# Altium schematic sheet Charger_S.CAP_BAT.SchDoc
size A3
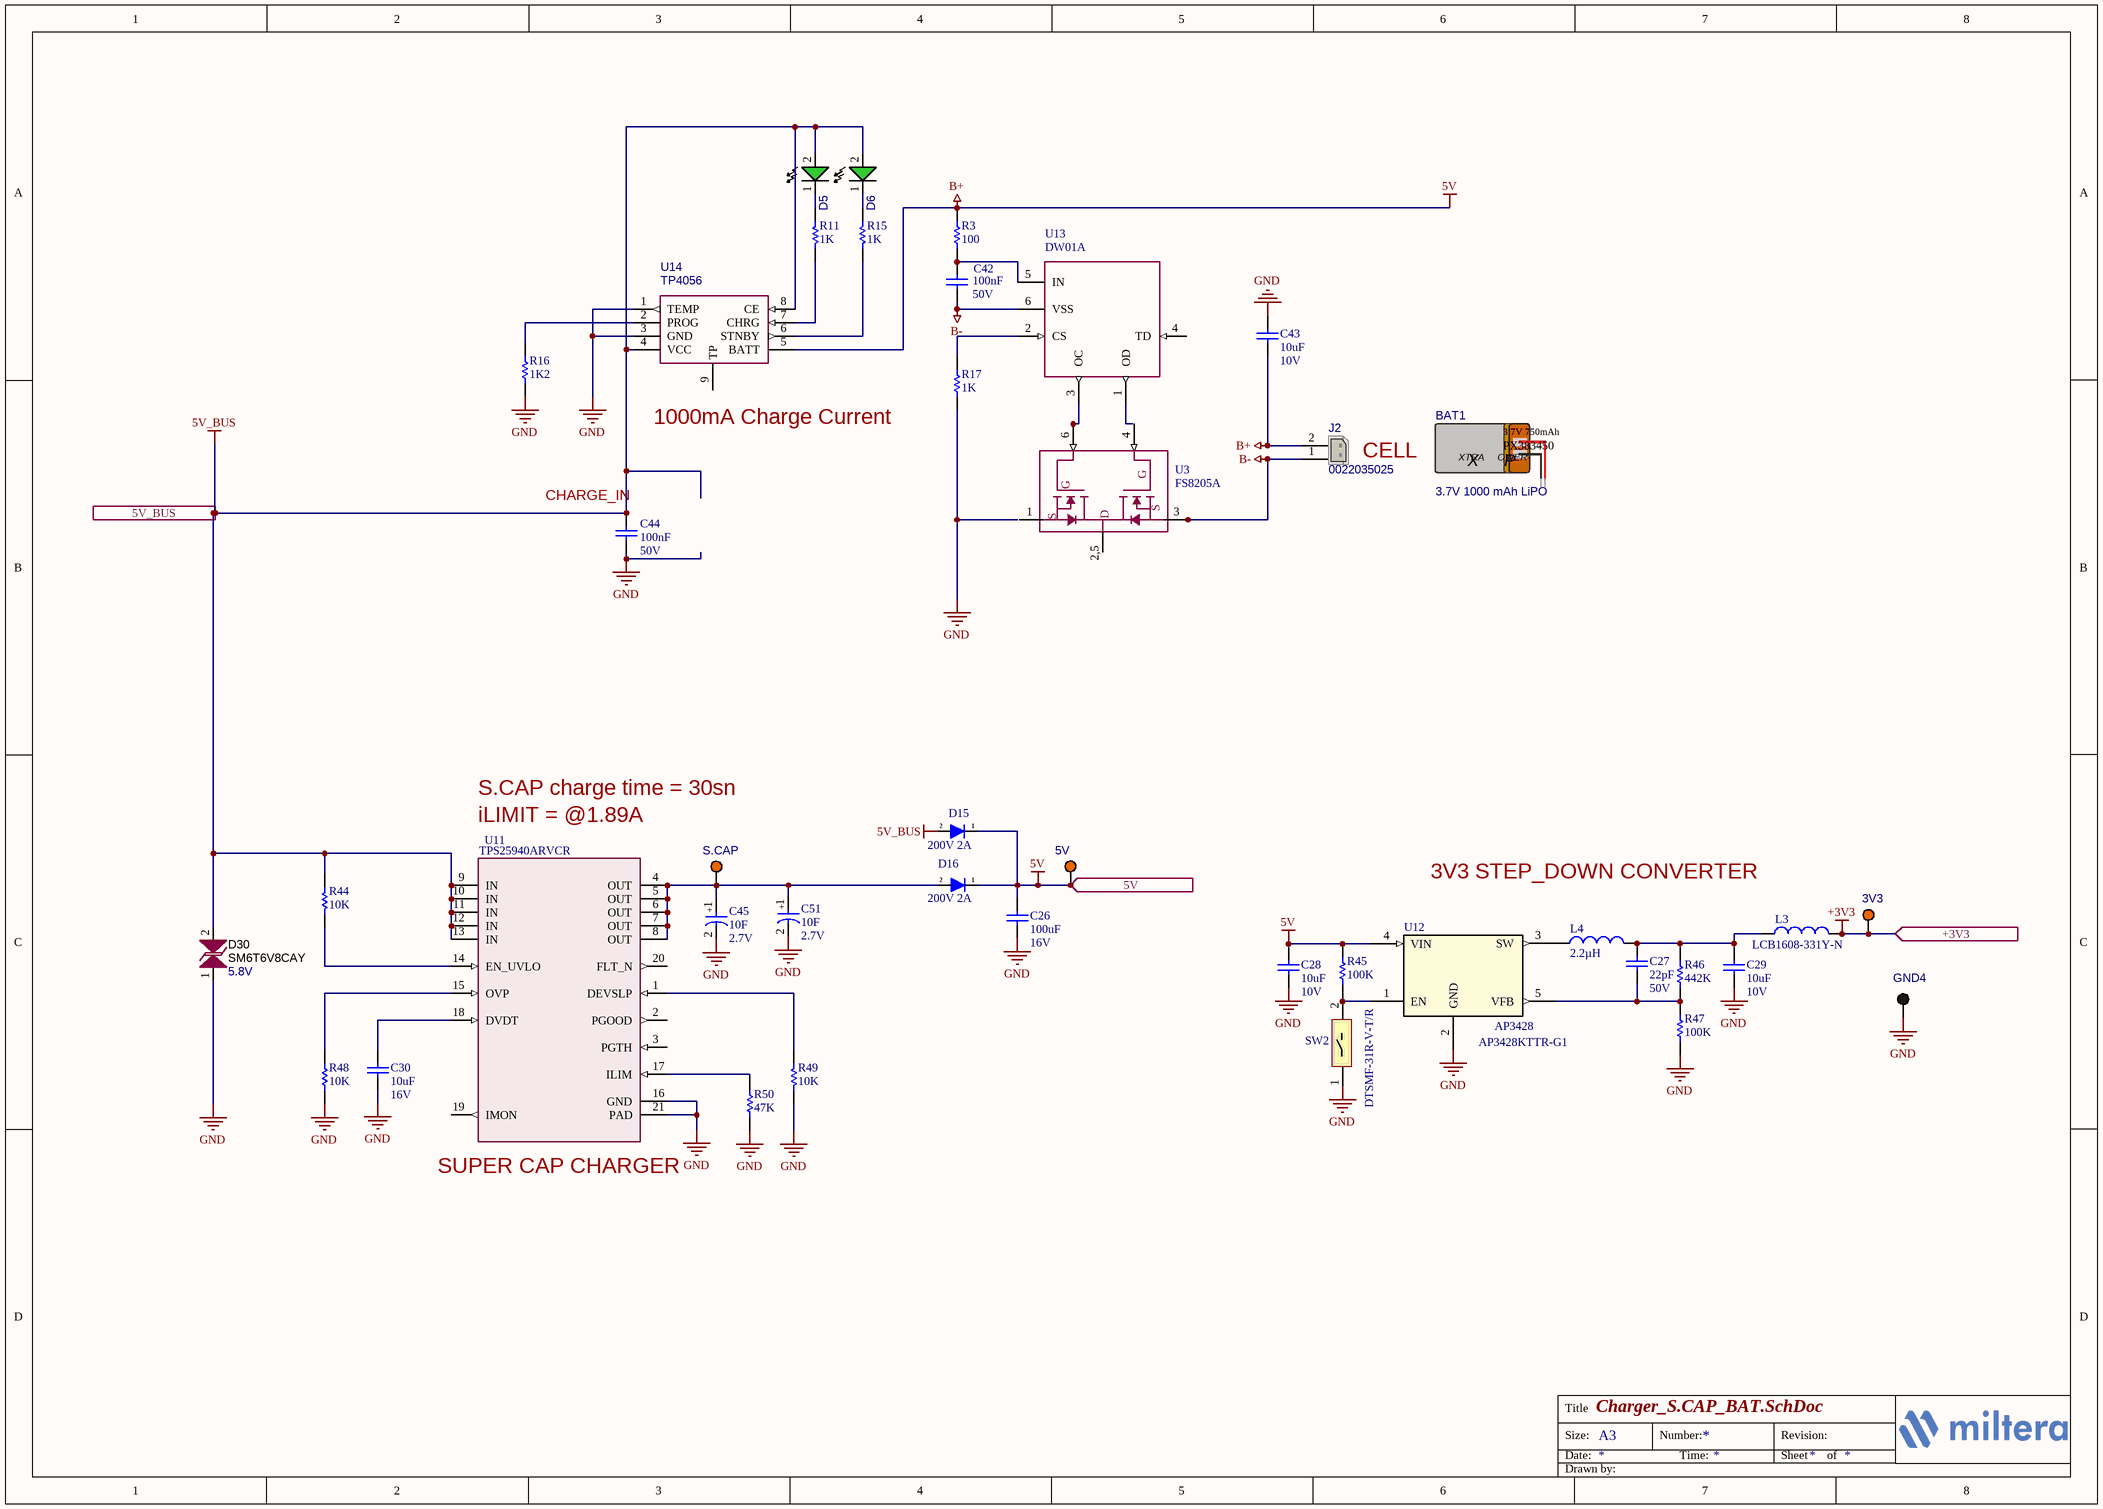
[diagram p0: Charger_S.CAP_BAT.SchDoc]

## Parts
3V3  L-KLS8-TP5003  [TEST_POINT_ORANGE]  (value not drawn)
5V  L-KLS8-TP5003  [TEST_POINT_ORANGE]  (value not drawn)
BAT1  value 3.7V 1000 mAh LiPO  (hidden comment: PX603450)  (mechanical)
C26  value 100uF  Voltage: 16V  [CAP_1210]  (hidden comment: C1210C107M4PACTU)
C27  value 22pF  Voltage: 50V  [CAP_0603]  (hidden comment: CAP)
C28  value 10uF  Voltage: 10V  [CAP_0603]  (hidden comment: CAP)
C29  value 10uF  Voltage: 10V  [CAP_0603]  (hidden comment: CAP)
C30  value 10uF  Voltage: 16V  [CAP_0603]  (hidden comment: CL10A106MO8NQNC)
C42  value 100nF  Voltage: 50V  [CAP_0603]  (hidden comment: CAP)
C43  value 10uF  Voltage: 10V  [CAP_0603]  (hidden comment: CAP)
C44  value 100nF  Voltage: 50V  [CAP_0603]  (hidden comment: CAP)
C45  value 10F  Voltage: 2.7V  [BUP002R7L106FK -EX]  (hidden comment: BUP002R7L106FK -EX)
C51  value 10F  Voltage: 2.7V  [BUP002R7L106FK -EX]  (hidden comment: BUP002R7L106FK -EX)
D5  PSC-1608U52GC-G4  [LED_0603_GRN]  (value not drawn)
D6  PSC-1608U52GC-G4  [LED_0603_GRN]  (value not drawn)
D15  Voltage: 200V 2A  [SMA]  (hidden comment: ES2D_R1_00001)
D16  Voltage: 200V 2A  [SMA]  (hidden comment: ES2D_R1_00001)
D30  SM6T6V8CAY  value 5.8V  [SMB-Bi]
GND4  L-KLS8-TP5001  [TEST_POINT_BLACK]  (value not drawn)
J2  0022035025  [0022035025]
L3  Manufacturer Part Number: LCB1608-331Y-N  [RES_0603]  (hidden comment: IND)
L4  value 2.2µH  [INDP4040X200M]  (hidden comment: IND)
R3  value 100  [RES_1206]  (hidden comment: RES)
R11  value 1K  [RES_0603]  (hidden comment: RES)
R15  value 1K  [RES_0603]  (hidden comment: RES)
R16  value 1K2  [RES_0603]  (hidden comment: 0603SAF1201T5E)
R17  value 1K  [RES_0603]  (hidden comment: RES)
R44  value 10K  [RES_0603]  (hidden comment: RES)
R45  value 100K  [RES_0603]  (hidden comment: RES)
R46  value 442K  [RES_0603]  (hidden comment: RES)
R47  value 100K  [RES_0603]  (hidden comment: RES)
R48  value 10K  [RES_0603]  (hidden comment: RES)
R49  value 10K  [RES_0603]  (hidden comment: RES)
R50  value 47K  [RES_0603]  (hidden comment: RES)
S.CAP  L-KLS8-TP5003  [TEST_POINT_ORANGE]  (value not drawn)
SW2  DTSMF-31R-V-T/R  [tact_switch]
U3  FS8205A  [SOT23-6]
U11  TPS25940ARVCR  [20-WFQFN Exposed Pad]
U12  AP3428  Manufacturer Part Number: AP3428KTTR-G1  [SOT-23-5]
U13  DW01A  [SOT23-6]
U14  TP4056  [SOP_8_PowerPAD]

## Ports
5V (in), 5V_BUS (in), +3V3 (in)

## Nets
5V: 5V.1 C26.2 C28.1 C43.2 D15.1 D16.1 J2.2 R3.2 R45.2 U12.4(VIN) U14.5(BATT) ; port 5V  [also labelled B+]
5V_BUS: C44.2 D5.2 D6.2 D15.2 D30.2 R44.2 U11.9(IN) U11.10(IN) U11.11(IN) U11.12(IN) U11.13(IN) U14.4(VCC) U14.8(CE) ; port 5V_BUS
+3V3: 3V3.1 L3.2 ; port +3V3
B-: C42.1 J2.1 U3.3(S2) U13.6(VSS)
GND: C26.1 C28.2 C29.2 C30.1 C43.1 C44.1 C45.2 C51.2 D30.1 GND4.1 R16.1 R17.1 R47.1 R48.2 R49.2 R50.2 SW2.1 U11.16(GND) U11.21(PAD) U12.2(GND) U14.1(TEMP) U14.3(GND)
NetC27_1: C27.1 C29.1 L3.1 L4.2 R46.1
NetC27_2: C27.2 R46.2 R47.2 U12.5(VFB)
NetC30_2: C30.2 U11.18(DVDT)
NetC42_2: C42.2 R3.1 U13.5(IN)
NetC45_1: C45.1 C51.1 D16.2 S.CAP.1 U11.4(OUT) U11.5(OUT) U11.6(OUT) U11.7(OUT) U11.8(OUT)
NetD5_1: D5.1 R11.1
NetD6_1: D6.1 R15.1
NetL4_1: L4.1 U12.3(SW)
NetR11_2: R11.2 U14.7(CHRG)
NetR15_2: R15.2 U14.6(STNBY)
NetR16_2: R16.2 U14.2(PROG)
NetR17_2: R17.2 U13.2(CS)
NetR44_1: R44.1 U11.14(EN_UVLO)
NetR45_1: R45.1 SW2.2 U12.1(EN)
NetR48_1: R48.1 U11.15(OVP)
NetR49_1: R49.1 U11.1(DEVSLP)
NetR50_1: R50.1 U11.17(ILIM)
NetU3_6: U3.6(G1) U13.3(OC)

Not connected (* = marked no-connect by the designer): U3 1(S1) 2,5(D1/D2) 4(G2); U11 2(PGOOD) 3(PGTH) 19(IMON) 20(FLT_N); U13 1(OD) 4(TD); U14 9(TP)

## Notes on the sheet
- (near U14) 1000mA Charge Current
- (near C44) CHARGE_IN
- (near J2) CELL
- iLIMIT = @1.89A
- S.CAP charge time = 30sn
- 3V3 STEP_DOWN CONVERTER
- (near U11) SUPER CAP CHARGER
- Title
- Size:
- Date:
- A3
- Number:
- Time:
- Revision:
- Sheet
- of
- Drawn by:
- (in symbol C01820) +
- (in symbol FS8205A) G; S; D
- (in symbol PX383450) 3.7V 750mAh; XTRA; OWER-; X; P

## Library data of the parts
3V3 5V S.CAP = 5003: PC TEST POINT MINIATURE ORANGE 2.54MMX4.60MM; Manufacturer: KLS ELECTRONIC; Package: 1mm THT Pad; Manufacturer Part Number: L-KLS8-TP5003
BAT1 = PX383450: Power-Xtra PX603450 3.7V 1000 mAh Li-Polymer Pil (Devreli/1.5A); Package: *; Manufacturer: Power-Xtra; Manufacturer Part Number: PX603450
C26 = C01763: MLCC (3225) 1210 100uF 16VDC ±20% X5R; Manufacturer: KEMET; Manufacturer Part Number: C1210C107M4PACTU
C27 = C01769: MLCC 0603 22pF 50VDC ±5% C0G (NP0); Manufacturer: Samsung; Manufacturer Part Number: CL10C220JB8NNNC
C28 C29 C43 = C01793: MLCC (1608) 0603 10uF 10VDC ±20% X5R; Manufacturer: Samsung; Manufacturer Part Number: CL10A106MP8NNNC
C30 = C01763: MLCC (1608) 0603 10uF 16VDC ±20% X5R; Manufacturer: Samsung; Manufacturer Part Number: CL10A106MO8NQNC
C42 C44 = C01763: CAP CER 100nF 50VDC %10 X7R SMD; Manufacturer: Samsung; Manufacturer Part Number: CL10B104KB8NNNL
C45 C51 = C01820: CAP.SUPER 10F 2.7V Radial TYPE 10x25mm; Manufacturer: BIGCAP; Manufacturer Part Number: BUP002R7L106FK -EX
D5 D6 = LTST-C190TGKT: LED GREEN WATER CLEAR 0603 SMD; Manufacturer: HONGLITRONIC; Package: 0603(1608 Metric); Manufacturer Part Number: PSC-1608U52GC-G4; Value: GREEN
D15 D16 = DIO00042: DIODE S.FAST SINGLE 2A 200V DO214AC (SMA) SMT; Manufacturer: PANJIT; Manufacturer Part Number: ES2D_R1_00001
D30 = SM6T6V8CAY: DIODE TVS 5.8VWM 13.4VC SMB; Manufacturer: STMicroelectronics; Manufacturer Part Number: SM6T6V8CAY; Package: SMB
GND4 = 5001: PC TEST POINT MINIATURE BLACK 2.54MMX4.60MM; Manufacturer: KLS ELECTRONIC; Package: 1mm THT Pad; Manufacturer Part Number: L-KLS8-TP5001
J2 = 0022035025: CONN HEADER VERT 2POS 2.5MM; Manufacturer: Molex; Package: TH; Manufacturer Part Number: 0022035025; Value: 0022035025
L3 = L000004: FERRITE BEAD 0603 330R/100MHZ SMD; Manufacturer: Core Master; Value: 330 Ohm @ 100MHz
L4 = IND0000019: INDUCTOR POWER 2.2UH 3.3X3MM SMD; Manufacturer: Core Master; Manufacturer Part Number: FPI0302-2R2M
R3 = R00977: RES SMD 100 OHM 1% 1/4W 1206; Manufacturer: Yageo; Manufacturer Part Number: RC1206FR-07100RL
R11 R15 R17 = R02998: RES 0603 1K Ohms 1% 1/10W-S 100PPM; Manufacturer: ROYALOHM; Manufacturer Part Number: 0603SAF1001T5E
R16 = R02998: RES.(1608) 0603 1.2K Ohms 1% 1/10W-S 100PPM; Manufacturer: ROYALOHM; Manufacturer Part Number: 0603SAF1201T5E
R44 R48 R49 = R02995: RES 0603 10k Ohms %1 1/10W 100PPM; Manufacturer: ROYALOHM; Manufacturer Part Number: 0603SAF1002T5E
R45 R47 = R03011: RES 0603 100K Ohms 1% 1/10W-S 100PPM; Manufacturer: ROYALOHM; Manufacturer Part Number: 0603SAF1003T5E
R46 = R03014: RES 0603 442K Ohms 1% 1/10W-S 100PPM; Manufacturer: ROYALOHM; Manufacturer Part Number: 0603SAF4423T5E
R50 = R03000: RES 0603 47K Ohms 1% 1/10W-S 100PPM; Manufacturer: ROYALOHM; Manufacturer Part Number: 0603SAF4702T5E
SW2 = Tact_Switch: SWITCH TACT 6.00x3.50 4.30mm 260gF SMT V/T; Manufacturer: DIPTRONICS; Manufacturer Part Number: DTSMF-31R-V-T/R
U3 = FS8205A: MOSFET 20V 9A SOT-23-6; Manufacturer: TECH PUBLIC; Manufacturer Part Number: FS8205A
U11 = TPS25940ARVCR: IC ELECTRONIC FUSE 8% 20WQFN; Manufacturer: Texas Instruments; Value: TPS25940ARVCR; Manufacturer Part Number: TPS25940ARVCR
U12 = P000198: Buck Switching Regulator IC Positive Adjustable 0.6V 1 Output 1A SOT-23-5 Thin, TSOT-23-5; Manufacturer: Diodes Incorporated
U13 = DW01A: IC-01 G BATTERY PROTECTION 1-CELL SOT23-6 FORTU; Manufacturer: YONGYUTAI; Manufacturer Part Number: DW01A
U14 = TP4056-42-SOP8-PP: 1A Lithium Battery Charger; Manufacturer: TPOWER; Package: 8SOIC; Manufacturer Part Number: TP4056; Value: TP4056